# EAGLE design ForceSensor (EAGLE 7.4.0)
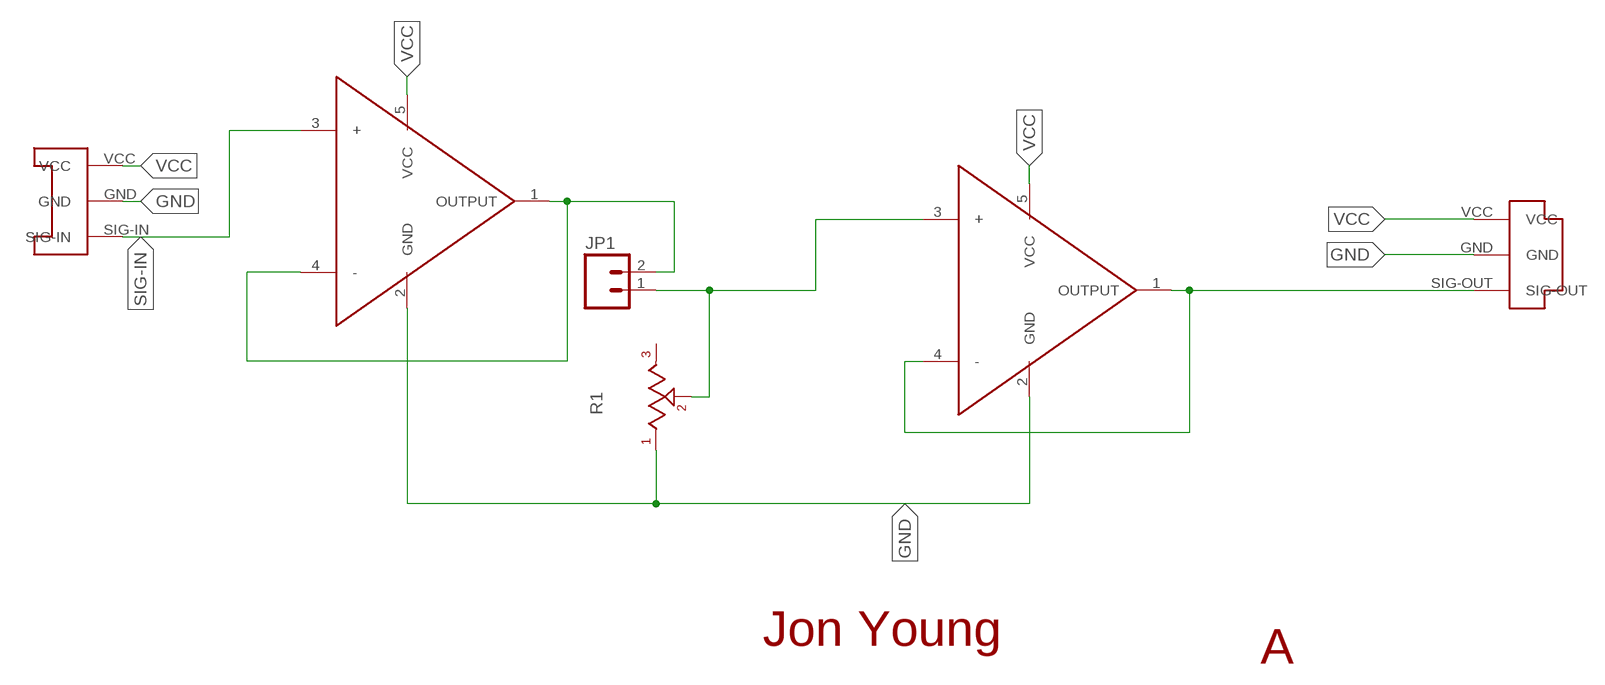
[diagram p0: schematic, sheet 1]

## Parts
JP1  M02PTH3  [1X02_LONGPADS]
R1  POT-TRIM-SMD-BOURNS-3314J-1  [POT-TRIM-SMD-BOURNS-3314]
U$1  CONN-PLUG-3POS-3MM  [PLUG-3POS-3MM-SMD]
U$2  CONN-SOCKET-3POS-3MM  [SOCKET-3POS-3MM-SMD]
U$3  OPAMP-MCP6001SOT23-5  [SOT23-5]
U$4  OPAMP-MCP6001SOT23-5  [SOT23-5]

## Nets
GND: R1.3 U$1.GND U$2.GND U$3.2(GND) U$4.2(GND)
N$5: U$1.SIG-OUT U$4.1(OUTPUT) U$4.4(-)
N$8: JP1.2 U$3.1(OUTPUT) U$3.4(-)
N$9: JP1.1 R1.2 U$4.3(+)
SIG-IN: U$2.SIG-IN U$3.3(+)
VCC: U$1.VCC U$2.VCC U$3.5(VCC) U$4.5(VCC)
Unconnected: R1.1

## Notes on the sheet
- Jon Young
- A

## Library data of the parts
JP1 = SparkFun-Connectors:M02: Standard 2-pin 0.1" header. Use with - straight break away headers ( PRT-00116) - right angle break away headers (PRT-00553) - swiss pins (PRT-00743) - machine pins (PRT-00117) - female headers (PRT-00115) Molex polarized connector foot print use with: PRT-08233 with associated crimp pins and housings. 2.54_SCREWTERM for use with PRT-10571. 3.5mm Screw Terminal footprints for PRT-08084 5mm Screw Terminal footprints for use with PRT-08432
R1 = LITTLEBITS140915:POT-TRIM-SMD-BOURNS-3314: Bourns 3314 - 4mm Square Trimming Potentiometer
U$1 = EmbeddedPlayground:CONN-PLUG-3POS-3MM: Surface mount board to board connector. Female socket, 3 position.
U$2 = EmbeddedPlayground:CONN-SOCKET-3POS-3MM: Surface mount board to board connector. Female socket, 3 position.
U$3 U$4 = EmbeddedPlayground:OPAMP-MCP6001

## Board
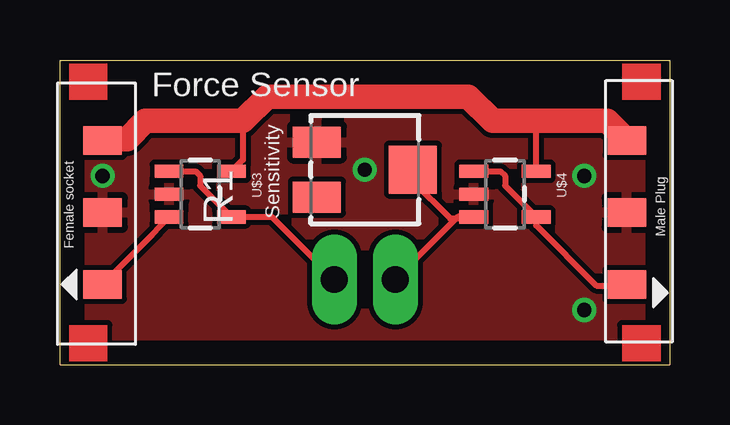
[diagram p1: board, top side]
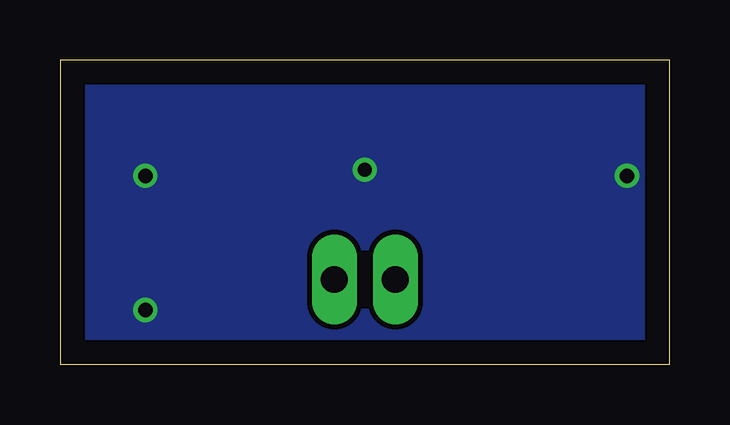
[diagram p2: board, bottom side, seen from below]

Size 25.4 x 12.7 mm. Coordinates in mm from the lower left corner, seen from the top.
Outline: 0,0 25.4,0 25.4,12.7 0,12.7 0,0
Copper layers (1*16): Top 0.035mm / dielectric 1.5mm / Bottom 0.035mm
Design rules "default": minimum track width 10mil, minimum drill 24mil, track to track 8mil, track to pad 8mil, pad to pad 8mil, via to via 8mil, smd to smd 8mil, copper to edge 40mil, drill to drill 8mil, minimum pad ring 10mil, minimum via ring 8mil, stop-mask expansion 4mil, vias tented up to drill 0mil, thermal gap 10mil

### Footprints (pad centres in the part's own frame; a part is rotated, then mirrored left to right if it is on the bottom)
1X02_LONGPADS = drill 1.118 pad 1.88 long: 1 0,0; 2 2.54,0
POT-TRIM-SMD-BOURNS-3314 = smd 1.3 x 2: 1 -1.15,2; 3 1.15,2 | smd 2 x 2: 2 0,-2
PLUG-3POS-3MM-SMD = smd 1.2 x 1.6: GND 0,0; SIG-OUT 3,0; VCC -3,0
SOCKET-3POS-3MM-SMD = smd 1.2 x 1.6: GND 0,0; SIG-IN -3,0; VCC 3,0
SOT23-5 = smd 0.55 x 1.2: 1 -0.95,-1.3; 2 0,-1.3; 3 0.95,-1.3; 4 0.95,1.3; 5 -0.95,1.3

### Placement (x,y rotation side)
JP1  13.97,3.56 180 top
R1  12.7,8.13 90 top
U$1  23.62,6.35 270 top
U$2  1.78,6.35 90 top
U$3  5.84,7.11 270 top
U$4  18.54,7.11 270 top

### Tracks (layer width: path | path; a pad name or v marks a point on that pad's centre or on a via)
GND  (via drill 0.6)
  other vias: 1.78,7.87 12.7,8.13 21.84,2.29 21.84,7.87
  pour Top: -1.27,13.91 -1.02,-1.27 29.37,-1.27 29.12,13.91
  pour Bottom: -1.27,13.91 26.58,13.91 26.58,-1.27 -1.27,-1.27
N$5
  Top 0.254: U$4.1 18.35,8.06 18.54,7.87 18.54,7.46 U$4.4 19.84,5.81 22.35,3.3 23.57,3.3 U$1.SIG-OUT
N$8
  Top 0.254: U$3.1 5.65,8.06 5.84,7.87 5.84,7.46 U$3.4 8.82,6.16 JP1.2
N$9
  Top 0.254: R1.2 14.7,7.65 16.26,6.1 17.18,6.1 U$4.3 16.58,6.16 JP1.1
SIG-IN
  Top 0.254: U$3.3 3.83,5.4 U$2.SIG-IN
VCC
  Top 0.254: 7.62,10.16 7.62,8.54 U$3.5 | U$4.5 19.84,9.94
  Top 0.406: 19.84,9.94 20.07,10.16
  Top 1.016: U$2.VCC 1.83,9.4 2.79,9.4 3.56,10.16 7.62,10.16 8.64,11.18 17.02,11.18 18.03,10.16 20.07,10.16 22.81,10.16 U$1.VCC

### Text on the board
tPlace: Force Sensor | Sensitivity